# EAGLE schematic main (EAGLE 7.3.0)
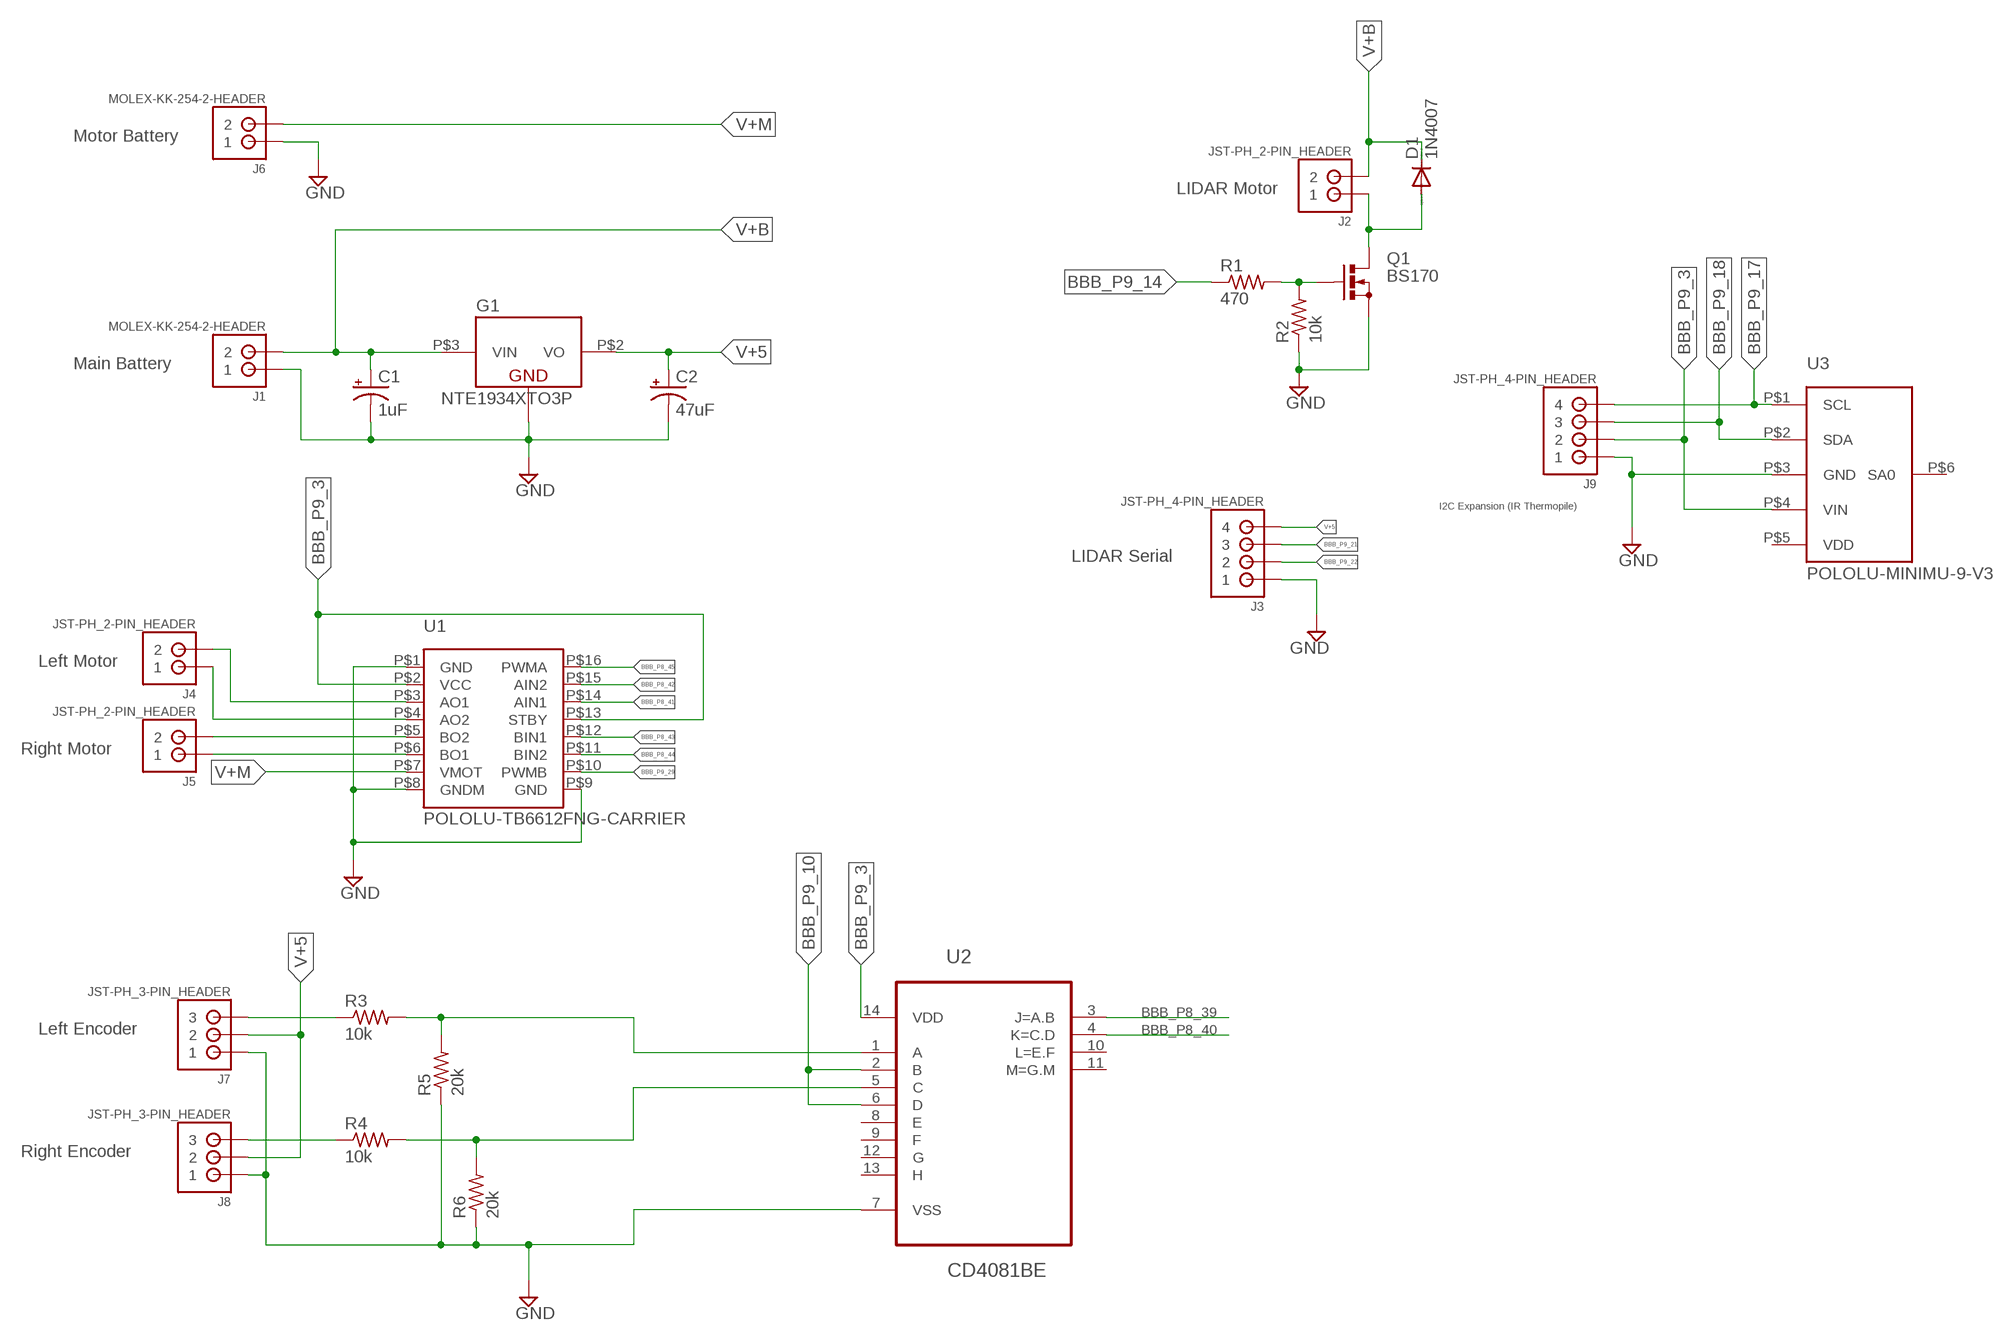
[diagram p0: schematic, sheet 1]

## Parts
C1  1uF  CPOL-USE1.8-4  [E1,8-4]
C2  47uF  CPOL-USE2-5  [E2-5]
D1  1N4007  1N4004  [DO41-10]
G1  NTE1934XTO3P  [TO3P]
J1  MOLEX-KK-254-2-HEADER  [MOLEX-KK-254-2-HEADER]
J2  JST-PH_2-PIN_HEADER  [JST_B2B-PH_HEADER]
J3  JST-PH_4-PIN_HEADER  [JST_B4B-PH_HEADER]
J4  JST-PH_2-PIN_HEADER  [JST_B2B-PH_HEADER]
J5  JST-PH_2-PIN_HEADER  [JST_B2B-PH_HEADER]
J6  MOLEX-KK-254-2-HEADER  [MOLEX-KK-254-2-HEADER]
J7  JST-PH_3-PIN_HEADER  [JST_B3B-PH_HEADER]
J8  JST-PH_3-PIN_HEADER  [JST_B3B-PH_HEADER]
J9  JST-PH_4-PIN_HEADER  [JST_B4B-PH_HEADER]
Q1  BS170  [SOT54E]
R1  470  R-US_0207/10  [0207/10]
R2  10k  R-US_0207/10  [0207/10]
R3  10k  R-US_0207/10  [0207/10]
R4  10k  R-US_0207/10  [0207/10]
R5  20k  R-US_0207/10  [0207/10]
R6  20k  R-US_0207/10  [0207/10]
U1  POLOLU-TB6612FNG-CARRIER  [POLOLU-TB6612FNG-CARRIER]
U2  CD4081BE  [DIP254P762X508-14]
U3  POLOLU-MINIMU-9-V3  [POLOLU-MINIMU-9-V3]

## Nets
BBB_P8_39: U2.3(J=A.B)
BBB_P8_39_AND_INPUT: R3.2 R5.2 U2.1(A)
BBB_P8_40: U2.4(K=C.D)
BBB_P8_40_AND_INPUT: R4.2 R6.2 U2.5(C)
BBB_P8_41: U1.P$14(AIN1)
BBB_P8_42: U1.P$15(AIN2)
BBB_P8_43: U1.P$12(BIN1)
BBB_P8_44: U1.P$11(BIN2)
BBB_P8_45: U1.P$16(PWMA)
BBB_P9_3: J9.P2 U1.P$2(VCC) U1.P$13(STBY) U2.14(VDD) U3.P$4(VIN)
BBB_P9_10: U2.2(B) U2.6(D)
BBB_P9_14: R1.1
BBB_P9_17: J9.P4 U3.P$1(SCL)
BBB_P9_18: J9.P3 U3.P$2(SDA)
BBB_P9_21: J3.P3
BBB_P9_22: J3.P2
BBB_P9_29: U1.P$10(PWMB)
GND: C1.- C2.- G1.P$1(GND) J1.P$1 J3.P1 J6.P$1 J7.P1 J8.P1 J9.P1 Q1.S R2.1 R5.1 R6.1 U1.P$1(GND) U1.P$8(GNDM) U1.P$9(GND) U2.7(VSS) U3.P$3(GND)
N$1: Q1.G R1.2 R2.2
N$2: D1.A J2.P1 Q1.D
N$3: J5.P1 U1.P$6(BO1)
N$4: J5.P2 U1.P$5(BO2)
N$5: J4.P1 U1.P$4(AO2)
N$6: J4.P2 U1.P$3(AO1)
N$7: J7.P3 R3.1
N$11: J8.P3 R4.1
V+5: C2.+ G1.P$2(VO) J3.P4 J7.P2 J8.P2
V+B: C1.+ D1.C G1.P$3(VIN) J2.P2
V+M: J6.P$2 U1.P$7(VMOT)
Unconnected: J1.P$2 U2.8(E) U2.9(F) U2.10(L=E.F) U2.11(M=G.M) U2.12(G) U2.13(H) U3.P$6(SA0)

## Notes on the sheet
- Motor Battery
- LIDAR Motor
- Main Battery
- I2C Expansion (IR Thermopile)
- LIDAR Serial
- Left Motor
- Right Motor
- Left Encoder
- Right Encoder

## Power pins joined to a net without a drawn wire
VDD: U3.P$5(VDD)

## Library data of the parts
C1 C2 = rcl:CPOL-US: POLARIZED CAPACITOR, American symbol
D1 = diode:1N4004: DIODE general purpose rectifier, 1 A
G1 = custom:NTE1934X
J1 J6 = custom:MOLEX-KK-254-2-HEADER: Molex KK 254 Wire to Board Header - 22-23-2021 Max current per contact: 4.0 A Max voltage: 250 V 0.1 inch pitch http://www.molex.com/molex/products/datasheet.jsp?part=active/0022232021_PCB_HEADERS.xml&channel=Products&Lang=en-US
J2 J4 J5 = SRG:JST-PH_2-PIN_HEADER: 2-pin JST PH Shrouded Header, top entry P/N B2B-PH-K-S Mating connector PHR-2 Mating cable assembly: Sparkfun PRT-09914 <http://www.sparkfun.com/products/9914>
J3 J9 = SRG:JST-PH_4-PIN_HEADER: 4-pin JST PH Shrouded Header, top entry P/N B4B-PH-K-S Mating connector PHR-4 Mating cable assembly: Sparkfun PRT-09916 <http://www.sparkfun.com/products/9916>
J7 J8 = SRG:JST-PH_3-PIN_HEADER: 3-pin JST PH Shrouded Header, top entry P/N B3B-PH-K-S Mating connector PHR-3
Q1 = transistor-small-signal:BS170: N-CHANNEL MOS FET
R1 R2 = rcl:R-US_: RESISTOR, American symbol
R3-R6 = resistor:R-US_: RESISTOR, American symbol
U1 = custom:POLOLU-TB6612FNG-CARRIER: Pololu TB6612FNG Dual Motor Driver Carrier Motor driver: TB6612FNG Motor channels: 2 Minimum operating voltage: 4.5 V Maximum operating voltage: 13.5 V Continuous output current per channel: 1 A Peak output current per channel: 3 A Continuous paralleled output current: 2 A Maximum PWM frequency: 100 kHz Minimum logic voltage: 2.7 V Maximum logic voltage: 5.5 V Reverse voltage protection?: Y Pololu item #: 713 (https://www.pololu.com/product/713)
U2 = custom:CD4081BE: CMOS AND Gates; MPN: CD4081BE; OC_FARNELL: 1106116; OC_NEWARK: 60K5134; PACKAGE: PDIP-14; SUPPLIER: Texas Instruments
U3 = custom:POLOLU-MINIMU-9-V3: Pololu MinIMU-9 v3 Gyro, Accelerometer, and Compass (L3GD20H and LSM303D Carrier) Dimensions Size: 0.8" × 0.5" × 0.1" Weight: 0.7 g General Specifications Interface: I²C Minimum operating voltage: 2.5 V Maximum operating voltage: 5.5 V Axes: pitch (x), roll (y), and yaw (z) Measurement range: ±245, ±500, or ±2000°/s (gyro) ±2, ±4, ±6, ±8, or ±16 g (accelerometer) ±2, ±4, ±8, or ±12 gauss (magnetometer) Supply current: 6 mA I2C Addresses Sensor Slave Address (default) Slave Address (SA0 driven low) L3GD20H (gyro) 1101011b 1101010b LSM303D (accelerometer and magnetometer) 0011101b 0011110b https://www.pololu.com/product/2468